# Altium schematic sheet Sheet2.SchDoc
size 594 x 420 mm; SheetNumber: 1; SheetTotal: 1
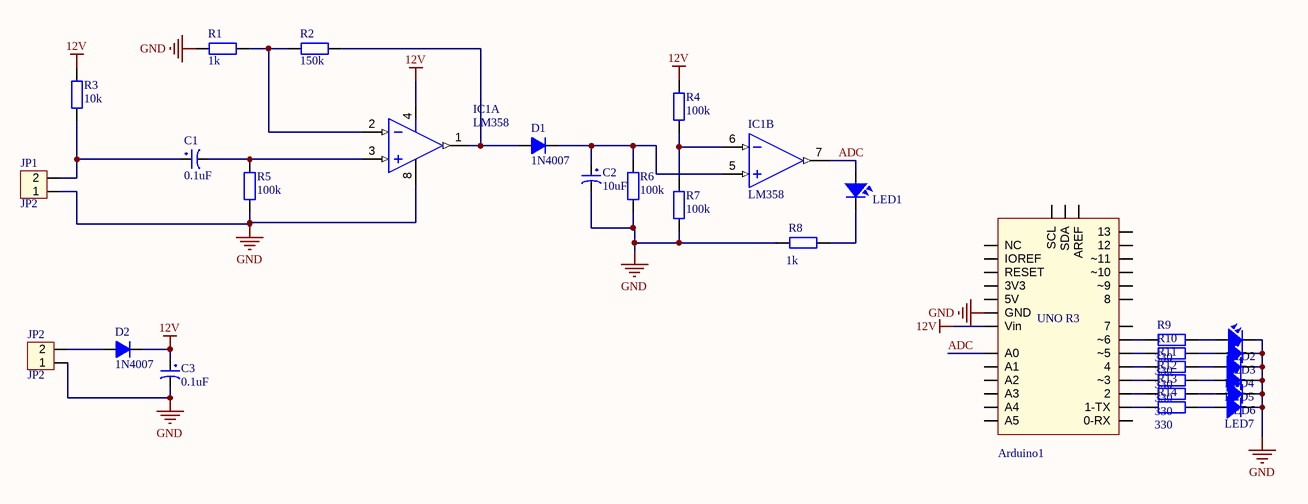
[diagram p0: Sheet2.SchDoc]

## Parts
Arduino1  Arduino Uno R3  [Arduino UNO R3]  (value not drawn)
C1  0.1uF  [CP1/2]
C2  10uF  [CP1/2]
C3  0.1uF  [CP1/2]
D1  1N4007  [D1A]
D2  1N4007  [D1A]
IC1  LM358  [DIP8]  (parts A,B of 2)
JP1  JP2  [CON2]
JP2  JP2  [CON2]
LED1  LED  [LED-3]  (value not drawn)
LED2  LED  [LED-3]  (value not drawn)
LED3  LED  [LED-3]  (value not drawn)
LED4  LED  [LED-3]  (value not drawn)
LED5  LED  [LED-3]  (value not drawn)
LED6  LED  [LED-3]  (value not drawn)
LED7  LED  [LED-3]  (value not drawn)
R1  1k  [R1/4W]
R2  150k  [R1/4W]
R3  10k  [R1/4W]
R4  100k  [R1/4W]
R5  100k  [R1/4W]
R6  100k  [R1/4W]
R7  100k  [R1/4W]
R8  1k  [R1/4W]
R9  330  [R1/4W]
R10  330  [R1/4W]
R11  330  [R1/4W]
R12  330  [R1/4W]
R13  330  [R1/4W]
R14  330  [R1/4W]

## Nets
12V: Arduino1.Vin C3.1 D2.2(K) IC1.4(-V) R3.2 R4.2
GND: Arduino1.GND C2.2 C3.2 IC1.8(+V) JP1.1 JP2.1 LED2.2 LED3.2 LED4.2 LED5.2 LED6.2 LED7.2 R1.2 R5.1 R6.1 R7.1 R8.2
ADC: Arduino1.A0 IC1.7(OUT) LED1.1
NetArduino1_1-TX: Arduino1.1-TX R14.2
NetArduino1_2: Arduino1.2 R13.2
NetArduino1_4: Arduino1.4 R11.2
NetArduino1_~3: Arduino1.~3 R12.2
NetArduino1_~5: Arduino1.~5 R10.2
NetArduino1_~6: Arduino1.~6 R9.2
NetC1_1: C1.1 JP1.2 R3.1
NetC1_2: C1.2 IC1.3(IN+) R5.2
NetC2_1: C2.1 D1.2(K) IC1.5(IN+) R6.2
NetD1_1: D1.1(A) IC1.1(OUT) R2.1
NetD2_1: D2.1(A) JP2.2
NetIC1_2: IC1.2(IN-) R1.1 R2.2
NetIC1_6: IC1.6(IN-) R4.1 R7.2
NetLED1_2: LED1.2 R8.1
NetLED2_1: LED2.1 R9.1
NetLED3_1: LED3.1 R10.1
NetLED4_1: LED4.1 R11.1
NetLED5_1: LED5.1 R12.1
NetLED6_1: LED6.1 R13.1
NetLED7_1: LED7.1 R14.1

Not connected (* = marked no-connect by the designer): Arduino1 0-RX 3V3 5V 7 8 12 13 A1 A2 A3 A4 A5 AREF IOREF NC RESET SCL SDA ~9 ~10 ~11

## Notes on the sheet
- DWG NO:
- REV:
- THIS DOCUMENT AND THE DATA DISCLOSED HEREIN OR
- HEREWITH IS THE PROPERTY OF ALTIUM LIMITED AND MAY
- BE FREELY DISTRIBUTED IN WHOLE. NO RIGHTS ARE
- RESERVED OR EXPRESS OR IMPLIED WARANTEE GIVEN.
- REVISION
- DESCRIPTION
- DATE
- APPROVED
- ENG:
- APPROVALS
- PROJECT
- DSN:
- CHK:
- REFERENCE DOCUMENTS
- PROJECT REVISION:
- TITLE
- DOCUMENT REVISION:
- DESIGN ITEM:
- BOM:
- FAB DWG:
- PCB DWG:
- ASSY DWG:
- SCALE:
- A2
- SIZE
- CAGE CODE
- FILE NAME
- DWG NO.
- SHEET
- OF
- REV
- (in symbol Arduino Uno R3) UNO R3

## Library data of the parts
Arduino1 = Arduino Uno R3: Value: Cau 1A
C1-C3 = CP1: Cap P  0,1uF < 22uF , 16 - 50V; Value: 10uF/50V; Description 1: 10 => 220uF/6,3V/10V - 10uF => 100uF/16V; Description 2: 0,1uF => 33uF/50V - 10uF => 22uF/63V; Description 3: 0,47uF => 10uF/100V
D1 D2 = D1A: Diode 1A; Value: 1N4007
IC1 = LM358: Low-Power Dual Operational Amplifier; Value: LM358
JP1 JP2 = Con2: Connector 2; Value: Connector 2
LED1-LED7 = LED: LED Single colour Green and Red; Value: LED 3 ly Single Colour
R1-R14 = R1/4W: Resistor 1/4W; Value: R1/4W - 1K